# Altium project LED Project.PrjPcb
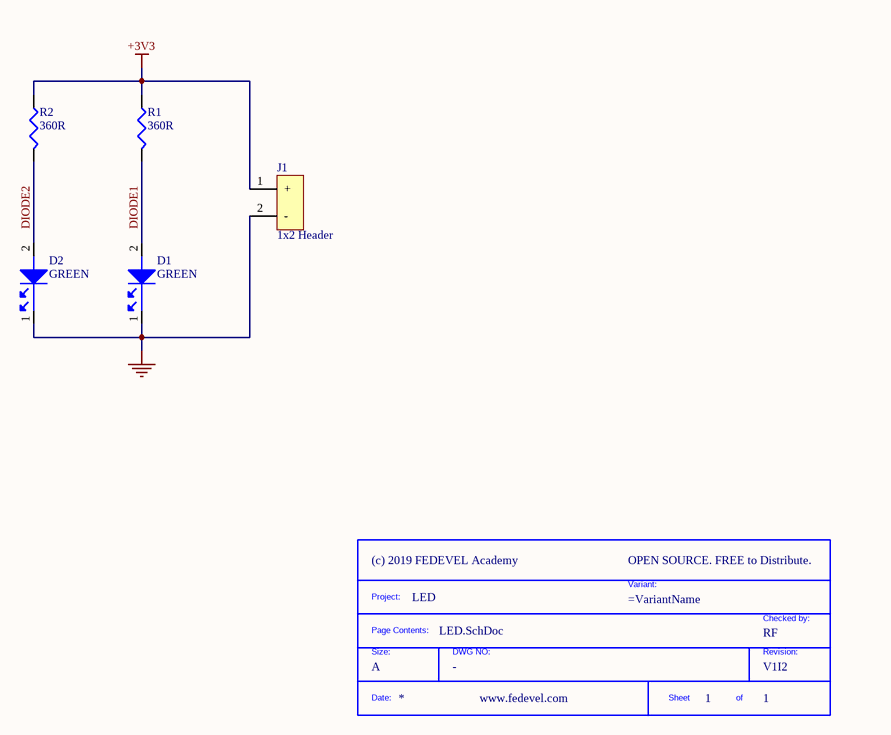
[diagram p0: LED.SchDoc]
VersionRevision: V1I2; Project: LED; DesignedByURL: www.fedevel.com; Company: (c) 2019 FEDEVEL Academy
1 sheet, 6 parts. Net scope: global (net labels, ports and power ports of the same name join across sheets).
Board file: LED.PcbDoc

## Sheet LED.SchDoc
size A; DocumentNumber: 1; SheetNumber: 1; SheetTotal: 1

### Parts
*  Size: A  Checked by: RF  (hidden comment: TitleBlock)  (graphical)
D1  GREEN  [LED0603G]
D2  GREEN  [LED0603G]
J1  1x2 Header  [HDR1X2]
R1  360R  [R0805]
R2  360R  [R0805]

### Nets
+3V3: J1.1(+) R1.1 R2.1
GND: D1.1 D2.1 J1.2(-)
DIODE1: D1.2 R1.2
DIODE2: D2.2 R2.2

### Notes on the sheet
- (in symbol TitleBlock) OPEN SOURCE. FREE to Distribute.; Project:; Variant:; Checked by:; Page Contents:; Size:; DWG NO:; Revision:; Date:; Sheet; of

### Library data of the parts
* = TitleBlock: Standard Title Block; DWG NO: -
D1 D2 = LNJ337W83RA: Standard LEDs - SMD LED GR HI-BRT USS; Manufacturer: Panasonic SSG; Colour: Green,Yellow; Luminous Intensity: 7.5mcd; Forward Voltage: 1.95V; Wavelength: 572nm; Forward Current: 20mA; Test Current: 5mA; Lens Style: Rectangular; Number of LEDs: 1; Max Power Dissipation: 55mW; Reverse Voltage: 4V; Supplier 1: Digi-Key; Supplier Part Number 1: LNJ337W83RADKR-ND; Manufacturer Part Number: LNJ337W83RA; Stock 1: 200597; Pricing 1: 1=0.48, 10=0.343, 25=0.28, 100=0.2239, 250=0.18888, 500=0.1609, 1000=0.12593, 2500=0.11544 (USD); Mount: Surface Mount; Case/Package: 0603; Number of Pins: 2; Case Code (Metric): 1608; Case Code (Imperial): 0603; Min Operating Temperature: -30°C; Max Operating Temperature: 85°C; Package Quantity: 1; Packaging: Tape and Reel; Illumination Colour: Green; Dominant Wavelength: 572nm; Length: 1.6mm; Height: 0.2mm; Width: 0.8mm; REACH SVHC: Yes; Lead Free: Lead Free; ComponentLink1URL: https://datasheet.ciiva.com/6868/lnj337w83ra-aek-6868817.pdf; ComponentLink1Description: https://datasheet.ciiva.com/6868/lnj337w83ra-aek-6868817.pdf; ComponentLink2URL: https://datasheet.ciiva.com/4690/lnj337w83ra-aek-226051-4690026.pdf; ComponentLink2Description: https://datasheet.ciiva.com/4690/lnj337w83ra-aek-226051-4690026.pdf; ComponentLink3URL: https://datasheet.ciiva.com/11775/0900766b80f0a8bb-11775418.pdf; ComponentLink3Description: https://datasheet.ciiva.com/11775/0900766b80f0a8bb-11775418.pdf; Category: Optoelectronics
J1 = 22-29-2021: Headers & Wire Housings 2 PIN F/LK HEADER; Manufacturer: Molex; Number of Positions: 2; Gender: Male; Contact Resistance: 10mR; Current Rating: 4A; Voltage Rating: 250V; Pitch: 2.54mm; Glow Wire Compliant: Non-compliant; Supplier 1: Digi-Key; Manufacturer Part Number: 22-29-2021; Stock 1: 17589; Pricing 1: 1=0.46, 10=0.431, 100=0.3014, 500=0.2583, 1000=0.21525, 5000=0.1845, 10000=0.1722 (USD); Mount: Through Hole; Housing Colour: White; Colour: White; Housing Material: Nylon; Contact Plating: Gold; Contact Material: Brass; Min Operating Temperature: 0°C; Max Operating Temperature: 75°C; Number of Rows: 1; Packaging: Bulk; Termination: Through Hole; Orientation: Straight; Number of Contacts: 2; Package Quantity: 2500; Number of Circuits: 2; Max Current Rating: 4A; Max Voltage Rating (AC): 250V; Voltage Rating (DC): 250V; Length: 12.7mm; Height: 11.7mm; Depth: 5.8mm; Radiation Hardening: No; Lead Free: Lead Free; REACH SVHC: Unknown; Halogen Free: Low Halogen; Flammability Rating: UL94 V-0; ComponentLink1URL: https://datasheet.ciiva.com/30169/113840022292021-pcb-headers-30169888.pdf; ComponentLink1Description: https://datasheet.ciiva.com/30169/113840022292021-pcb-headers-30169888.pdf; ComponentLink2URL: https://datasheet.ciiva.com/19472/879588-19472951.pdf; ComponentLink2Description: https://datasheet.ciiva.com/19472/879588-19472951.pdf; ComponentLink3URL: https://datasheet.ciiva.com/11752/0900766b80d5fb7a-11752634.pdf; ComponentLink3Description: https://datasheet.ciiva.com/11752/0900766b80d5fb7a-11752634.pdf; ComponentLink4URL: https://datasheet.ciiva.com/5153/0022292021-pcb-headers-159390-5153053.pdf; ComponentLink4Description: https://datasheet.ciiva.com/5153/0022292021-pcb-headers-159390-5153053.pdf; ComponentLink5URL: https://datasheet.ciiva.com/9468/0022292021-pcb-headers-9468301.pdf; ComponentLink5Description: https://datasheet.ciiva.com/9468/0022292021-pcb-headers-9468301.pdf; ComponentLink6URL: https://datasheet.ciiva.com/25908/0022292021-pcb-headers-25908286.pdf; ComponentLink6Description: https://datasheet.ciiva.com/25908/0022292021-pcb-headers-25908286.pdf; Supplier Part Number 1: WM2744-ND; Category: Connectors
R1 R2 = CRCW0805360RFKEA: RES SMD 360 OHM 1% 1/8W 0805; Manufacturer: Vishay; Temperature Coefficient: 100ppm/°C; Max Power Dissipation: 125mW; Voltage Rating (DC): 150V; Supplier 1: Digi-Key; Supplier Part Number 1: 541-360CDKR-ND; Manufacturer Part Number: CRCW0805360RFKEA; Stock 1: 29980; Pricing 1: 1=0.1, 10=0.055, 100=0.0223, 1000=0.01003, 2500=0.0087 (USD); Case/Package: 0805; Number of Pins: 2; Weight: 0.000194oz; Case Code (Metric): 2012; Case Code (Imperial): 0805; Contact Plating: Tin; Min Operating Temperature: -55°C; Max Operating Temperature: 155°C; Resistance: 360R; Tolerance: 1%; Packaging: Tape and Reel; Composition: Thick Film; Package Quantity: 10; Number of Terminations: 2; Power Rating: 125mW; Voltage Rating: 150V; Termination: SMD/SMT; Military Standard: Not; Features: Automotive AEC-Q200; Length: 2mm; Height: 0.45mm; Width: 0.049inch; Depth: 1.25mm; Radiation Hardening: No; Lead Free: Lead Free; REACH SVHC: Unknown; ComponentLink1URL: https://datasheet.ciiva.com/11812/0900766b80d98b26-11812609.pdf; ComponentLink1Description: https://datasheet.ciiva.com/11812/0900766b80d98b26-11812609.pdf; ComponentLink2URL: https://datasheet.ciiva.com/7881/1697337-7881957.pdf; ComponentLink2Description: https://datasheet.ciiva.com/7881/1697337-7881957.pdf; ComponentLink3URL: https://datasheet.ciiva.com/7881/1697337-7881958.pdf; ComponentLink3Description: https://datasheet.ciiva.com/7881/1697337-7881958.pdf; ComponentLink4URL: https://datasheet.ciiva.com/8942/dcrcwe3-8942598.pdf; ComponentLink4Description: https://datasheet.ciiva.com/8942/dcrcwe3-8942598.pdf; ComponentLink5URL: https://datasheet.ciiva.com/22674/1847332-22674713.pdf; ComponentLink5Description: https://datasheet.ciiva.com/22674/1847332-22674713.pdf; ComponentLink6URL: https://datasheet.ciiva.com/2467/dcrcwe3-2467773.pdf; ComponentLink6Description: https://datasheet.ciiva.com/2467/dcrcwe3-2467773.pdf; ComponentLink7URL: https://datasheet.ciiva.com/2467/dcrcwe3-2467774.pdf; ComponentLink7Description: https://datasheet.ciiva.com/2467/dcrcwe3-2467774.pdf; ComponentLink8URL: https://datasheet.ciiva.com/5543/dcrcwe3-109170-5543710.pdf; ComponentLink8Description: https://datasheet.ciiva.com/5543/dcrcwe3-109170-5543710.pdf; ComponentLink9URL: https://datasheet.ciiva.com/2467/dcrcwe3-2467775.pdf; ComponentLink9Description: https://datasheet.ciiva.com/2467/dcrcwe3-2467775.pdf; Category: Resistors

## Assembly variants
LED2 Not Fitted: not fitted D2 R2